# Altium schematic sheet Power_Relay.SchDoc
size A4; SheetNumber: 8; SheetTotal: 11
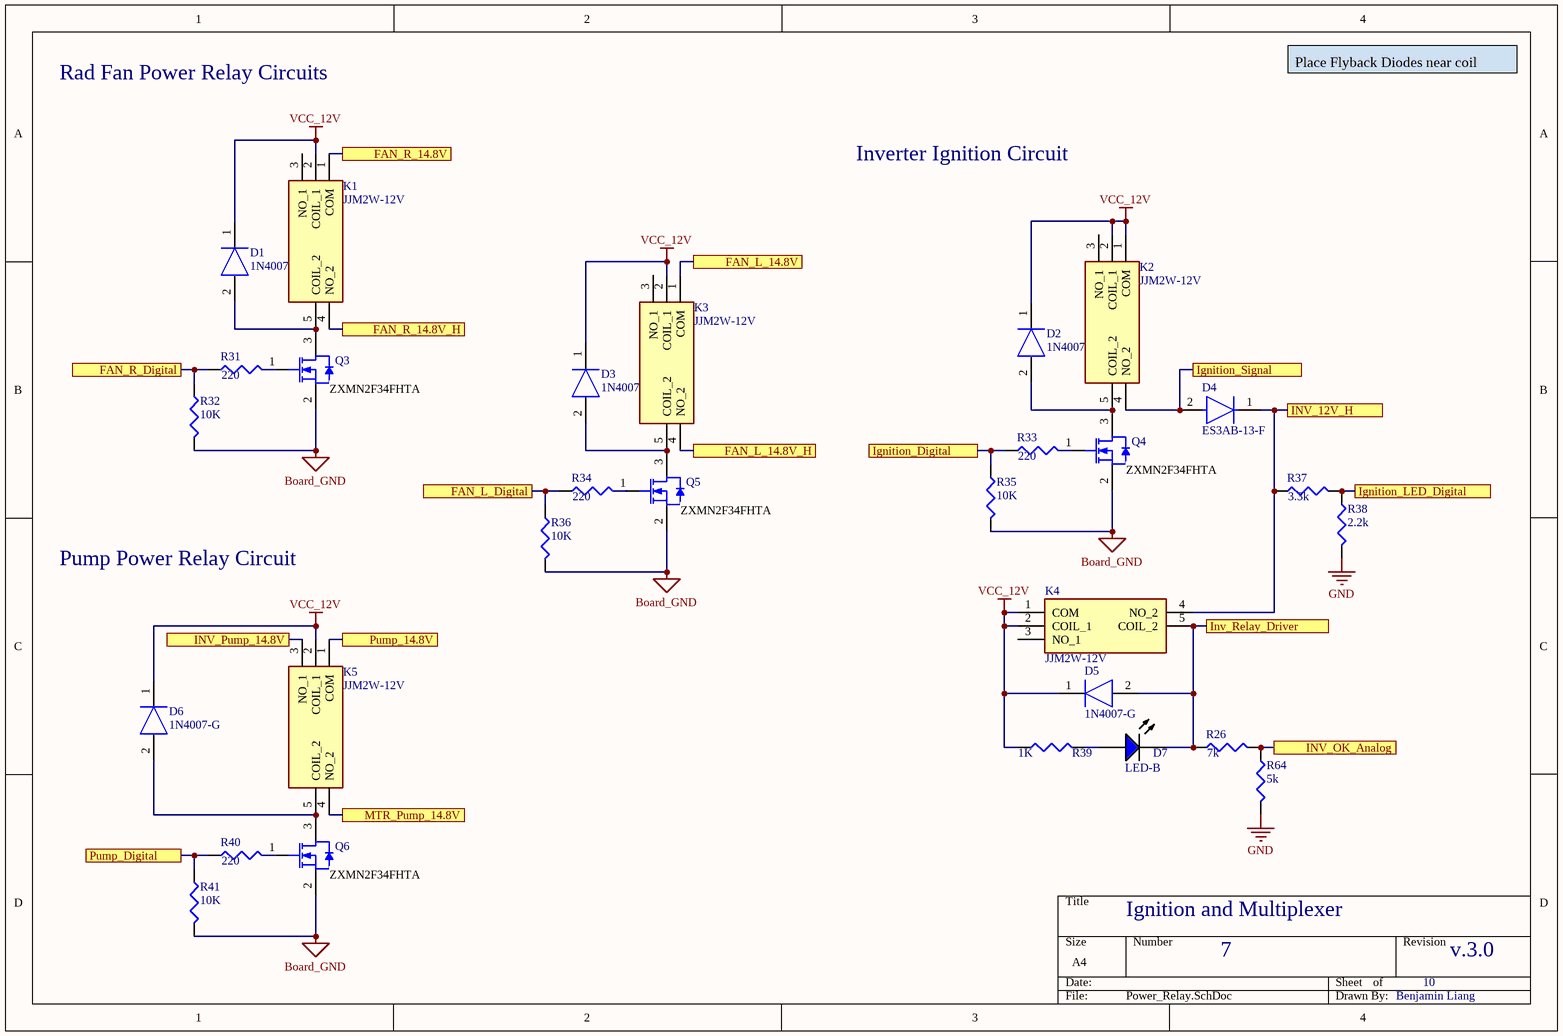
[diagram p0: Power_Relay.SchDoc]

## Parts
D1  1N4007-G  [DIOAD1410W90L470D235]
D2  1N4007-G  [DIOAD1410W90L470D235]
D3  1N4007-G  [DIOAD1410W90L470D235]
D4  ES3AB-13-F  [FP-SMB-MFG]
D5  1N4007-G  [DIOAD1410W90L470D235]
D6  1N4007-G  [DIOAD1410W90L470D235]
D7  LED-B  [LTST-C193TBKT_V]
K1  JJM2W-12V  [JJM2W12V]
K2  JJM2W-12V  [JJM2W12V]
K3  JJM2W-12V  [JJM2W12V]
K4  JJM2W-12V  [JJM2W12V]
K5  JJM2W-12V  [JJM2W12V]
Q3  ZXMN2F34FHTA  [FAIR-SSOT3L-3_V]  (value not drawn)
Q4  ZXMN2F34FHTA  [FAIR-SSOT3L-3_V]  (value not drawn)
Q5  ZXMN2F34FHTA  [FAIR-SSOT3L-3_V]  (value not drawn)
Q6  ZXMN2F34FHTA  [FAIR-SSOT3L-3_V]  (value not drawn)
R26  7k  [J1-0603]
R31  220  [J1-0603]
R32  10K  [J1-0603]
R33  220  [J1-0603]
R34  220  [J1-0603]
R35  10K  [J1-0603]
R36  10K  [J1-0603]
R37  3.3k  [J1-0603]
R38  2.2k  [J1-0603]
R39  1K  [J1-0603]
R40  220  [J1-0603]
R41  10K  [J1-0603]
R64  5k  [J1-0603]

## Ports
FAN_L_14.8V, FAN_L_14.8V_H, FAN_L_Digital, FAN_R_14.8V, FAN_R_14.8V_H, FAN_R_Digital, Ignition_Digital, Ignition_LED_Digital, Ignition_Signal, INV_12V_H, INV_OK_Analog, INV_Pump_14.8V, Inv_Relay_Driver, MTR_Pump_14.8V, Pump_14.8V, Pump_Digital

## Nets
Board_GND: Q3.2(S) Q4.2(S) Q5.2(S) Q6.2(S) R32.2 R35.2 R36.2 R41.2
GND: R38.2 R64.2
VCC_12V: D1.1(K) D2.1(K) D3.1(K) D5.1(K) D6.1(K) K1.2(COIL_1) K2.1(COM) K2.2(COIL_1) K3.2(COIL_1) K4.1(COM) K4.2(COIL_1) K5.2(COIL_1) R39.1
FAN_L_14.8V: K3.1(COM) ; port FAN_L_14.8V
FAN_L_14.8V_H: K3.4(NO_2) ; port FAN_L_14.8V_H
FAN_L_Digital: R34.1 R36.1 ; port FAN_L_Digital
FAN_R_14.8V: K1.1(COM) ; port FAN_R_14.8V
FAN_R_14.8V_H: K1.4(NO_2) ; port FAN_R_14.8V_H
FAN_R_Digital: R31.1 R32.1 ; port FAN_R_Digital
Ignition_Digital: R33.1 R35.1 ; port Ignition_Digital
Ignition_LED_Digital: R37.2 R38.1 ; port Ignition_LED_Digital
Ignition_Signal: D4.2(A) K2.4(NO_2) ; port Ignition_Signal
INV_12V_H: D4.1(C) K4.4(NO_2) R37.1 ; port INV_12V_H
INV_OK_Analog: R26.2 R64.1 ; port INV_OK_Analog
INV_Pump_14.8V: K5.3(NO_1) ; port INV_Pump_14.8V
Inv_Relay_Driver: D5.2(A) D7.2(K) K4.5(COIL_2) R26.1 ; port Inv_Relay_Driver
MTR_Pump_14.8V: K5.4(NO_2) ; port MTR_Pump_14.8V
Pump_14.8V: K5.1(COM) ; port Pump_14.8V
Pump_Digital: R40.1 R41.1 ; port Pump_Digital
NetD1_2: D1.2(A) K1.5(COIL_2) Q3.3(D)
NetD2_2: D2.2(A) K2.5(COIL_2) Q4.3(D)
NetD3_2: D3.2(A) K3.5(COIL_2) Q5.3(D)
NetD6_2: D6.2(A) K5.5(COIL_2) Q6.3(D)
NetD7_1: D7.1(A) R39.2
NetQ3_1: Q3.1(G) R31.2
NetQ4_1: Q4.1(G) R33.2
NetQ5_1: Q5.1(G) R34.2
NetQ6_1: Q6.1(G) R40.2

Not connected (* = marked no-connect by the designer): K1 3(NO_1); K2 3(NO_1); K3 3(NO_1); K4 3(NO_1)

## Notes on the sheet
- Rad Fan Power Relay Circuits
- Place Flyback Diodes near coil
- Inverter Ignition Circuit
- (near Q3) ZXMN2F34FHTA
- (near Q5) ZXMN2F34FHTA
- (near Q4) ZXMN2F34FHTA
- Pump Power Relay Circuit
- (near Q6) ZXMN2F34FHTA
- Ignition and Multiplexer
- 7
- 10
- v.3.0
- Benjamin Liang

## Library data of the parts
D1-D3 D5 D6 = 1N4007-G: Diode; Manufacturer_Name: Comchip Technology; Datasheet Link: https://datasheet.datasheetarchive.com/originals/distributors/Datasheets-DGA23/1390217.pdf; Manufacturer_Part_Number: 1N4007-G; Mouser Part Number: 750-1N4007-G; Mouser Price/Stock: https://www.mouser.co.uk/ProductDetail/Comchip-Technology/1N4007-G?qs=2qJf6qQ4IOKzApuByvlhjQ%3D%3D; Arrow Part Number: 1N4007-G; Arrow Price/Stock: https://www.arrow.com/en/products/1n4007-g/comchip-technology?region=nac
D4 = CMP-12791-000010-1: DIODE GEN PURP 50V 3A SMB; Manufacturer: Diodes; Capacitance: 45pF; Standoff Height: 0.05mm; Max Surge Forward Current: 100A; Peak Reverse Current: 10uA; Max Junction Temp: +150°C; Value: 45pF; Reverse Voltage: 50V; Device Class L3: Rectifier Diodes; Max Repetitive Reverse Voltage: 50V; Footprint Url: https://www.diodes.com/assets/Package-Files/SMB.pdf; Mouser Description: Rectifiers 50V 3A; RoHS: TRUE; Device Class L2: Diodes; Forward Current: 3A; ComponentLink2Description: Datasheet; Package: SMB; Temperature Range High: +150°C; Manufacturer Part Number: ES3AB-13-F; Temperature: -55°C to +150°C; Device Class L1: Discrete Semiconductors; Octopart: https://octopart.com/es3ab-13-f-diodes+inc.-328916; Temperature Range Low: -55°C; Height: 2.5mm; Automotive: No; ComponentLink2URL: https://forum.upverter.com/uploads/short-url/2fx1zdCm0X7KnJF0hsWL21N8TrX.pdf; Lead Free: Yes; Category: Diode; Digikey Description: DIODE GEN PURP 50V 3A SMB
D7 = CMP-2000-06624-1: LED Uni-Color Blue, 76 mW, 20 mA, -20 to 80 degC, 2-Pin SMD, RoHS, Tape and Reel / LTST-C193TBKT-5A; Viewing Angle: 130deg; Wavelength/Color Temperature: 465nmto475nm; Brand: Lite-On; Forward Voltage: 2.8V; LED Size: 1.6mmx0.8mmx0.35mm; Luminous Intensity: 15mcd; Forward Current: 5mA; Package / Case: 0603; Mounting Technology: SurfaceMount; Datasheet URL: https://datasheet.ciiva.com/15201/getdatasheetpartid-293056-15201395.pdf; Illumination Color: Blue; Maximum Operating Temperature: +80C; Datasheet Version: 08/2011; Package Description: 2-Pin Surface Mount Device, Body 0.8 x 1.6 mm; Manufacturer: Lite-On; Factory Pack Quantity: 3000; RoHS: Details; Minimum Operating Temperature: -20C; Packaging: Reel; Manufacturer URL: http://www.us.liteon.com/; Product Category: StandardLEDs-SMD; Package Reference: C193TBKT
K1-K5 = JJM2W-12V: Relay or Contactor; Manufacturer_Name: Panasonic; Datasheet Link: https://componentsearchengine.com/Datasheets/1/JJM2w-12V.pdf; Height: 14mm; Manufacturer_Part_Number: JJM2W-12V; Mouser Part Number: 769-JJM2W-12V; Mouser Price/Stock: https://www.mouser.com/Search/Refine.aspx?Keyword=769-JJM2W-12V; Arrow Part Number: JJM2W-12V; Arrow Price/Stock: https://www.arrow.com/en/products/jjm2w-12v/panasonic
Q3-Q6 = CMP-2000-06249-1: Manufacturer: FairchildSemiconductor; RDS-on: 0.07@4.5VOhm; Typical Fall Time: 3ns; Maximum Drain Source Voltage: 20V; Rad Hard: No; Channel Mode: Enhancement; Package Version: Rev. 3, 05/2015; Maximum Gate Source Voltage: ±8V; Typical Rise Time: 8.5ns; Typical Turn-Off Delay Time: 11ns; Maximum Continuous Drain Current: 1.7A; Channel Type: N; Typical Turn-On Delay Time: 5ns; Packaging: Tape&Reel; Mounting Technology: SurfaceMount; Mounting: SurfaceMount; Manufacturer URL: https://www.fairchildsemi.com/; Datasheet URL: https://www.fairchildsemi.com/datasheets/FD/FDN335N.pdf; Package Description: 3-Pin Small Outline Transistor, Body 2.92 x 1.4 mm, Pitch 0.95 mm; Package URL: https://www.fairchildsemi.com/package-drawings/MA/MA03B.pdf; Datasheet Version: Rev. C, 04/1999; Package Reference: SSOT3L; Package: 3SuperSOT; Operating Temperature: -55to150°C; Category: MOSFET
R26 R31 R33 R34 R37-R40 R64 = Res3: Resistor; Value: 10K; Published: 8-Jun-2000; LatestRevisionDate: 29-May-2009; LatestRevisionNote: IPC-7351 Footprint Added.; PackageReference: J1-0603; Publisher: Altium Limited; PackageDescription: Chip Resistor
R32 R35 R36 R41 = Res3: Resistor; Published: 8-Jun-2000; LatestRevisionDate: 29-May-2009; LatestRevisionNote: IPC-7351 Footprint Added.; PackageReference: J1-0603; Publisher: Altium Limited; PackageDescription: Chip Resistor; Value: 10K